# Altium project MotBoard-v6.PrjPcb
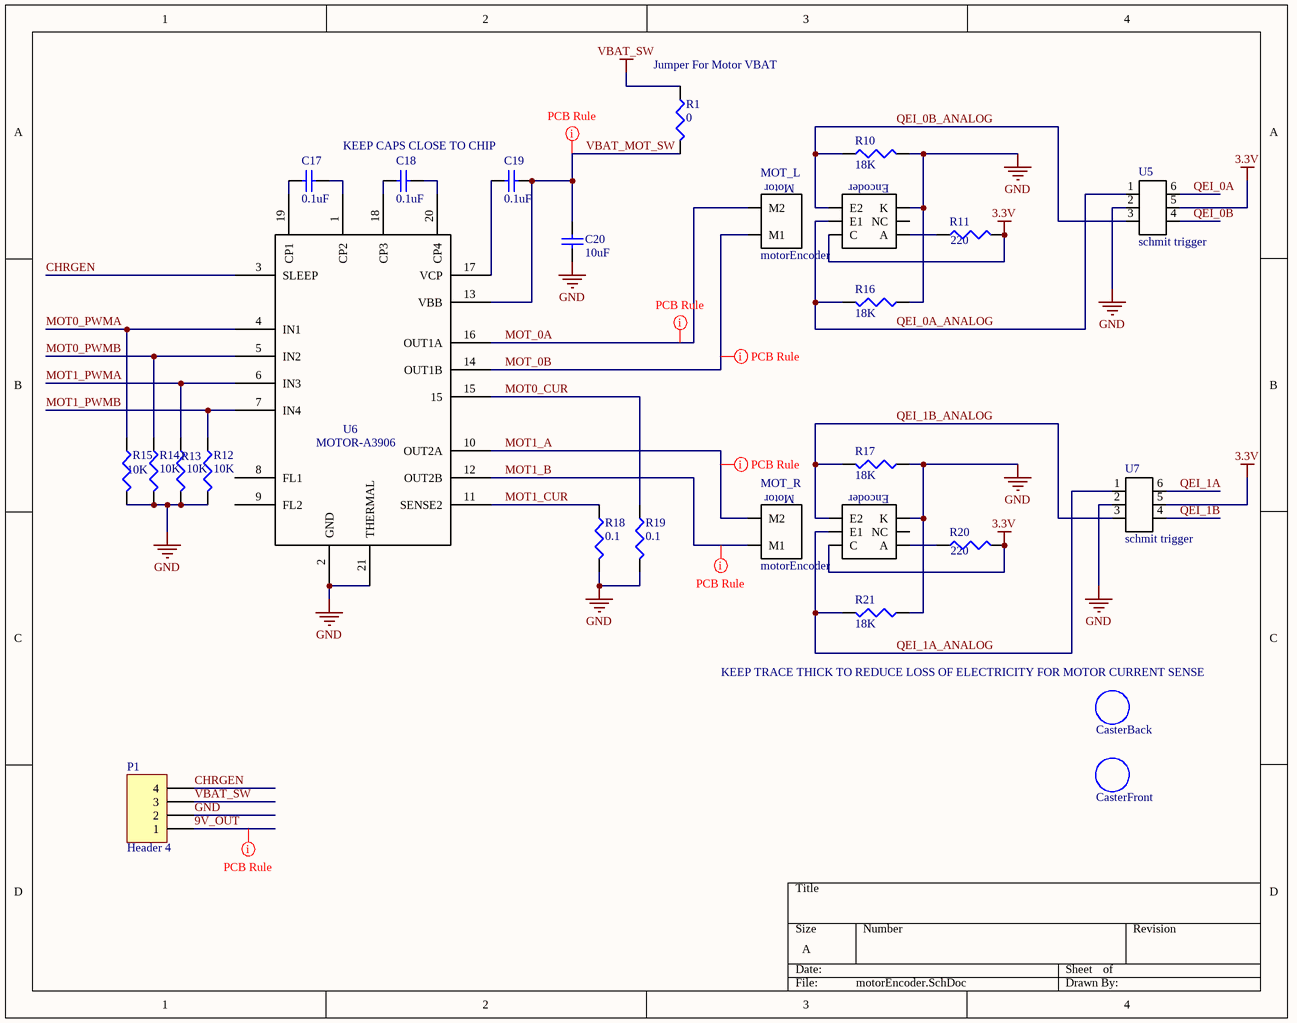
[diagram p0: motorEncoder.SchDoc]
2 sheets, 43 parts. Net scope: global (net labels, ports and power ports of the same name join across sheets).
Board file: MotorPCB-v6.PcbDoc
Sheets:
  motorEncoder.SchDoc
  GyroAccelHeaders.SchDoc

## Sheet motorEncoder.SchDoc
size A

### Parts
C17  value 0.1uF  [CAPC1005L]  (hidden comment: Cap Semi)
C18  value 0.1uF  [CAPC1005L]  (hidden comment: Cap Semi)
C19  value 0.1uF  [CAPC1005L]  (hidden comment: Cap Semi)
C20  value 10uF  [CAPC1608L]  (hidden comment: Cap Semi)
CasterBack  non connect  [3/8"Caster]  (value not drawn)
CasterFront  non connect  [3/8"Caster]  (value not drawn)
MOT_L  motorEncoder  [motorEncoder]
MOT_R  motorEncoder  [motorEncoder]
P1  Header 4  [HDR1X4]
R1  value 0  [RESC3225L]  (hidden comment: Res3)
R10  value 18K  [RESC1608L]
R11  value 220  [RESC1608L]
R12  value 10K  [RESC1608L]  (hidden comment: Res3)
R13  value 10K  [RESC1608L]  (hidden comment: Res3)
R14  value 10K  [RESC1608L]  (hidden comment: Res3)
R15  value 10K  [RESC1608L]  (hidden comment: Res3)
R16  value 18K  [RESC1608L]
R17  value 18K  [RESC1608L]
R18  value 0.1  [RESC1608L]  (hidden comment: Res3)
R19  value 0.1  [RESC1608L]  (hidden comment: Res3)
R20  value 220  [RESC1608L]
R21  value 18K  [RESC1608L]
U5  schmit trigger  [DCK(R-PDSO-C6)]
U6  MOTOR-A3906  [QFN-20]
U7  schmit trigger  [DCK(R-PDSO-C6)]

### Nets
3.3V: MOT_L.C MOT_R.C R11.2 R20.2 U5.5 U7.5
GND: C20.1 MOT_L.K MOT_R.K P1.2 R10.2 R12.2 R13.2 R14.2 R15.2 R16.1 R17.1 R18.2 R19.2 R21.1 U5.2 U6.2(GND) U6.21(THERMAL) U7.2
VBAT_SW: P1.3 R1.1
9V_OUT: P1.1
CHRGEN: P1.4 U6.3(SLEEP)
MOT0_CUR: R19.1 U6.15
MOT0_PWMA: R15.1 U6.4(IN1)
MOT0_PWMB: R14.1 U6.5(IN2)
MOT1_A: MOT_R.M2 U6.10(OUT2A)
MOT1_B: MOT_R.M1 U6.12(OUT2B)
MOT1_CUR: R18.1 U6.11(SENSE2)
MOT1_PWMA: R13.1 U6.6(IN3)
MOT1_PWMB: R12.1 U6.7(IN4)
MOT_0A: MOT_L.M2 U6.16(OUT1A)
MOT_0B: MOT_L.M1 U6.14(OUT1B)
QEI_0A: U5.6
QEI_0A_ANALOG: MOT_L.E1 R16.2 U5.1
QEI_0B: U5.4
QEI_0B_ANALOG: MOT_L.E2 R10.1 U5.3
QEI_1A: U7.6
QEI_1A_ANALOG: MOT_R.E1 R21.2 U7.1
QEI_1B: U7.4
QEI_1B_ANALOG: MOT_R.E2 R17.2 U7.3
VBAT_MOT_SW: C19.1 C20.2 R1.2 U6.13(VBB)
NetC17_1: C17.1 U6.19(CP1)
NetC17_2: C17.2 U6.1(CP2)
NetC18_1: C18.1 U6.18(CP3)
NetC18_2: C18.2 U6.20(CP4)
NetC19_2: C19.2 U6.17(VCP)
NetMOT_L_A: MOT_L.A R11.1
NetMOT_R_A: MOT_R.A R20.1

Not connected (* = marked no-connect by the designer): MOT_L NC; MOT_R NC; U6 8(FL1) 9(FL2)

### Layout directives
rule Width Constraint [Pref Width = 20mil    Min Width = 10mil    Max Width = 25mil]: 9V_OUT, MOT1_A, MOT1_B, MOT_0A, MOT_0B, VBAT_MOT_SW

### Notes on the sheet
- (near R1) Jumper For Motor VBAT
- KEEP CAPS CLOSE TO CHIP
- (near CasterBack) KEEP TRACE THICK TO REDUCE LOSS OF ELECTRICITY FOR MOTOR CURRENT SENSE
- (in symbol motorEncoder) Motor; Encoder

### Library data of the parts
C17-C20 = Cap Semi: Capacitor (Semiconductor SIM Model); Published: 8-Jun-2000; LatestRevisionDate: 29-May-2009; LatestRevisionNote: IPC-7351 Footprint Added.; PackageReference: C1206; Publisher: Altium Limited; PackageDescription: Chip Capacitor
CasterBack CasterFront = Caster: This is just a space saver to get the caster onto the pcb
P1 = Header 4: Header, 4-Pin; LatestRevisionDate: 17-Jul-2002; LatestRevisionNote: Re-released for DXP Platform.; Publisher: Altium Limited
R1 R10-R21 = Res3: Resistor; Published: 8-Jun-2000; LatestRevisionDate: 29-May-2009; LatestRevisionNote: IPC-7351 Footprint Added.; PackageReference: J1-0603; Publisher: Altium Limited; PackageDescription: Chip Resistor

## Sheet GyroAccelHeaders.SchDoc
size A
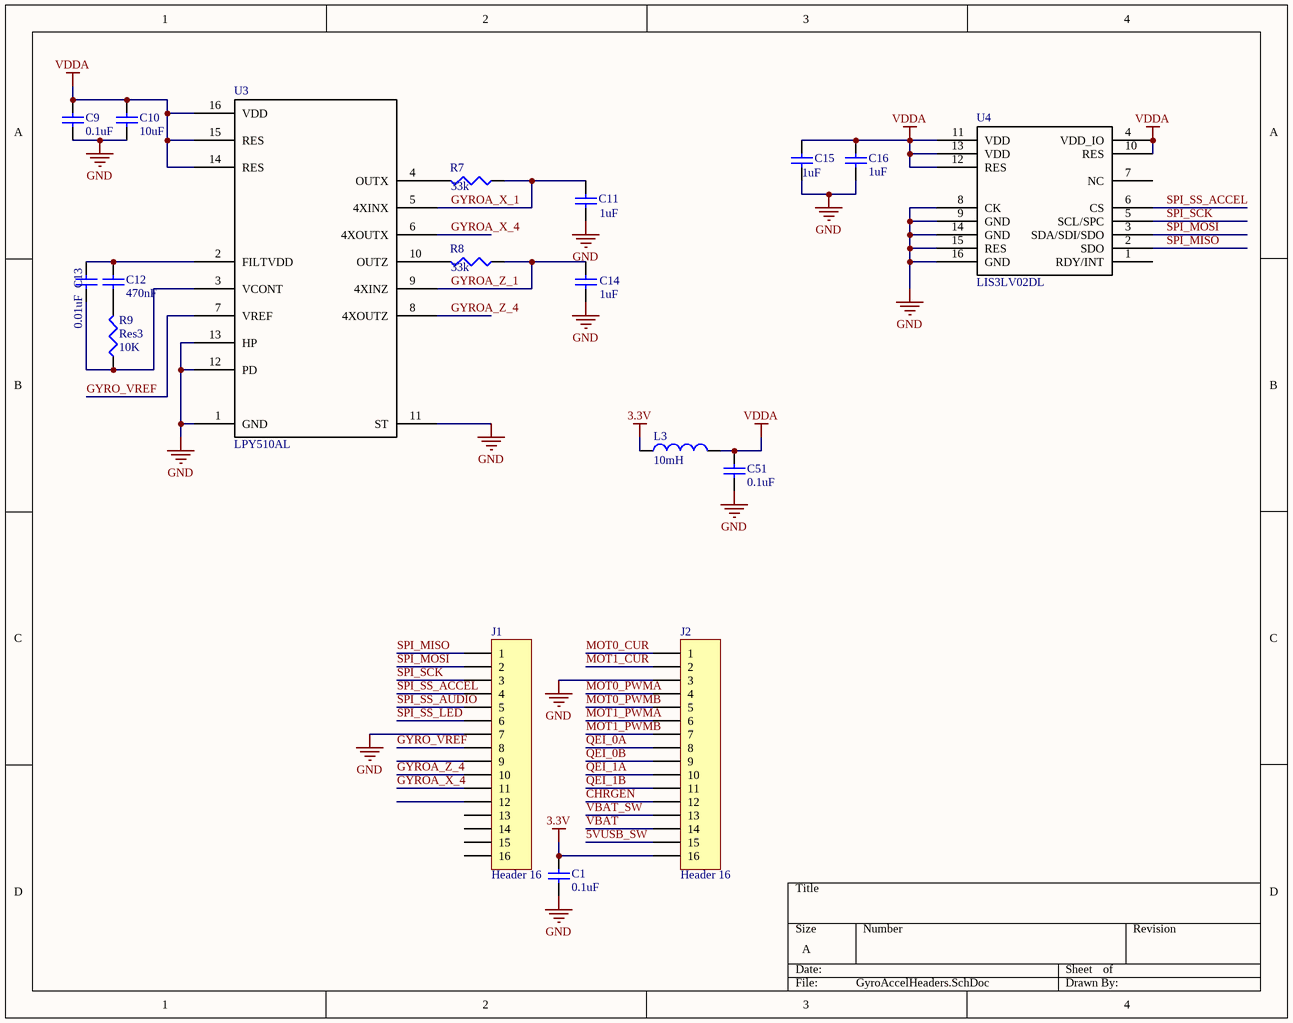
[diagram p1: GyroAccelHeaders.SchDoc]

### Parts
C1  value 0.1uF  [CAPC3216L]  (hidden comment: Cap Semi)
C9  value 0.1uF  [CAPC1005L]  (hidden comment: Cap Semi)
C10  value 10uF  [CAPC1608L]  (hidden comment: Cap Semi)
C11  value 1uF  [CAPC1608L]  (hidden comment: Cap Semi)
C12  value 470nF  [CAPC1005L]  (hidden comment: Cap Semi)
C13  value 0.01uF  [CAPC1005L]  (hidden comment: Cap Semi)
C14  value 1uF  [CAPC1608L]  (hidden comment: Cap Semi)
C15  value 1uF  [CAPC1608L]  (hidden comment: Cap Semi)
C16  value 1uF  [CAPC1608L]  (hidden comment: Cap Semi)
C51  value 0.1uF  [CAPC1005L]  (hidden comment: Cap Semi)
J1  Header 16  [HDR1X16]
J2  Header 16  [HDR1X16]
L3  value 10mH  [INDC2012L]  (hidden comment: Inductor)
R7  value 33k  [RESC1608L]  (hidden comment: Res3)
R8  value 33k  [RESC1608L]  (hidden comment: Res3)
R9  Res3  value 10K  [RESC1608L]
U3  LPY510AL  [LGA16]
U4  LIS3LV02DL  [LGA16 (4.4x7.5x1 mm)]

### Nets
3.3V: C1.2 J2.16 L3.2
GND: C1.1 C9.1 C10.1 C11.1 C14.1 C15.1 C16.1 C51.1 J1.7 J2.3 U3.1(GND) U3.11(ST) U3.12(PD) U3.13(HP) U4.8(CK) U4.9(GND) U4.14(GND) U4.15(RES) U4.16(GND)
VBAT_SW: J2.13
VDDA: C9.2 C10.2 C15.2 C16.2 C51.2 L3.1 U3.14(RES) U3.15(RES) U3.16(VDD) U4.4(VDD_IO) U4.10(RES) U4.11(VDD) U4.12(RES) U4.13(VDD)
5VUSB_SW: J2.15
CHRGEN: J2.12
GYRO_VREF: J1.8 U3.7(VREF)
GYROA_X_1: C11.2 R7.1 U3.5(4XINX)
GYROA_X_4: J1.11 U3.6(4XOUTX)
GYROA_Z_1: C14.2 R8.1 U3.9(4XINZ)
GYROA_Z_4: J1.10 U3.8(4XOUTZ)
MOT0_CUR: J2.1
MOT0_PWMA: J2.4
MOT0_PWMB: J2.5
MOT1_CUR: J2.2
MOT1_PWMA: J2.6
MOT1_PWMB: J2.7
QEI_0A: J2.8
QEI_0B: J2.9
QEI_1A: J2.10
QEI_1B: J2.11
SPI_MISO: J1.1 U4.2(SDO)
SPI_MOSI: J1.2 U4.3(SDA/SDI/SDO)
SPI_SCK: J1.3 U4.5(SCL/SPC)
SPI_SS_ACCEL: J1.4 U4.6(CS)
SPI_SS_AUDIO: J1.5
SPI_SS_LED: J1.6
VBAT: J2.14
NetC12_1: C12.1 R9.2
NetC12_2: C12.2 C13.2 U3.2(FILTVDD)
NetC13_1: C13.1 R9.1 U3.3(VCONT)
NetR7_2: R7.2 U3.4(OUTX)
NetR8_2: R8.2 U3.10(OUTZ)

Not connected (* = marked no-connect by the designer): J1 9 12 13 14 15 16; U4 1(RDY/INT) 7(NC)

### Library data of the parts
C1 C9-C16 C51 = Cap Semi: Capacitor (Semiconductor SIM Model); Published: 8-Jun-2000; LatestRevisionDate: 29-May-2009; LatestRevisionNote: IPC-7351 Footprint Added.; PackageReference: C1206; Publisher: Altium Limited; PackageDescription: Chip Capacitor
J1 J2 = Header 16: Header, 16-Pin; LatestRevisionDate: 17-Jul-2002; LatestRevisionNote: Re-released for DXP Platform.; Publisher: Altium Limited
L3 = Inductor: Code_IEC: 1005; Published: 8-Jun-2000; LatestRevisionDate: 29-May-2009; LatestRevisionNote: IPC-7351 Footprint Added.; PackageReference: 0402-A; Publisher: Altium Limited; PackageDescription: Chip Inductor; Code_JEITA: 0402
R7-R9 = Res3: Resistor; Published: 8-Jun-2000; LatestRevisionDate: 29-May-2009; LatestRevisionNote: IPC-7351 Footprint Added.; PackageReference: J1-0603; Publisher: Altium Limited; PackageDescription: Chip Resistor

## Nets that join several sheets
3.3V: motorEncoder (6 pins), GyroAccelHeaders (C1.2 J2.16 L3.2)
GND: motorEncoder (18 pins), GyroAccelHeaders (19 pins)
VBAT_SW: motorEncoder (P1.3 R1.1), GyroAccelHeaders (J2.13)
CHRGEN: motorEncoder (P1.4 U6.3), GyroAccelHeaders (J2.12)
MOT0_CUR: motorEncoder (R19.1 U6.15), GyroAccelHeaders (J2.1)
MOT0_PWMA: motorEncoder (R15.1 U6.4), GyroAccelHeaders (J2.4)
MOT0_PWMB: motorEncoder (R14.1 U6.5), GyroAccelHeaders (J2.5)
MOT1_CUR: motorEncoder (R18.1 U6.11), GyroAccelHeaders (J2.2)
MOT1_PWMA: motorEncoder (R13.1 U6.6), GyroAccelHeaders (J2.6)
MOT1_PWMB: motorEncoder (R12.1 U6.7), GyroAccelHeaders (J2.7)
QEI_0A: motorEncoder (U5.6), GyroAccelHeaders (J2.8)
QEI_0B: motorEncoder (U5.4), GyroAccelHeaders (J2.9)
QEI_1A: motorEncoder (U7.6), GyroAccelHeaders (J2.10)
QEI_1B: motorEncoder (U7.4), GyroAccelHeaders (J2.11)